# Altium schematic sheet 5V0BUCK.SchDoc
size A
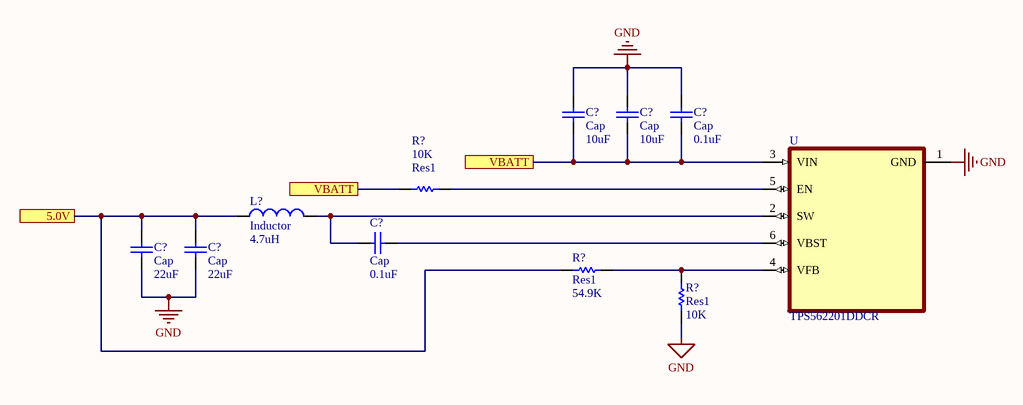
[diagram p0: 5V0BUCK.SchDoc]

## Parts
(Parts that share a designator on the sheet are numbered #1, #2 ... from top to bottom, then left to right.)
C?#1  Cap  value 10uF  [RAD-0.3]
C?#2  Cap  value 10uF  [RAD-0.3]
C?#3  Cap  value 0.1uF  [RAD-0.3]
C?#4  Cap  value 0.1uF  [RAD-0.3]
C?#5  Cap  value 22uF  [RAD-0.3]
C?#6  Cap  value 22uF  [RAD-0.3]
L?  Inductor  value 4.7uH  [0402-A]
R?#1  Res1  value 10K  [AXIAL-0.3]
R?#2  Res1  value 54.9K  [AXIAL-0.3]
R?#3  Res1  value 10K  [AXIAL-0.3]
U  TPS562201DDCR  [SOT95P280X110-6N]

## Ports
5.0V, VBATT

## Nets
GND: C?#1.2 C?#2.2 C?#3.2 C?#5.1 C?#6.1 R?#3.1 U.1(GND)
5.0V: C?#5.2 C?#6.2 L?.1 R?#2.2 ; port 5.0V
VBATT: C?#1.1 C?#2.1 C?#3.1 R?#1.2 U.3(VIN) ; port VBATT
NetC?#4_1: C?#4.1 L?.2 U.2(SW)
NetC?#4_2: C?#4.2 U.6(VBST)
NetR?#1_1: R?#1.1 U.5(EN)
NetR?#2_1: R?#2.1 R?#3.2 U.4(VFB)

## Library data of the parts
C?#1-C?#6 = Cap: Capacitor; Published: 8-Jun-2000; LatestRevisionDate: 17-Jul-2002; LatestRevisionNote: Re-released for DXP Platform.; PackageReference: RAD-0.3; Publisher: Altium Limited; PackageDescription: Radial Cap, Thru-Hole; 2 Leads; 0.3 in Pin Spacing
L? = Inductor: Code_IEC: 1005; Published: 8-Jun-2000; LatestRevisionDate: 29-May-2009; LatestRevisionNote: IPC-7351 Footprint Added.; PackageReference: 0402-A; Publisher: Altium Limited; PackageDescription: Chip Inductor; Code_JEITA: 0402
R?#1-R?#3 = Res1: Resistor; Published: 8-Jun-2000; LatestRevisionDate: 17-Jul-2002; LatestRevisionNote: Re-released for DXP Platform.; PackageReference: AXIAL-0.3; Publisher: Altium Limited; PackageDescription: Axial Device, Thru-Hole; 2 Leads; 0.3 in Pin Spacing
U = TPS562201DDCR: 4.5 V to 17 V input, 2 A output, synchronous step-down converter in Eco-mode 6-SOT-23-THIN -40 to 125; MF: Texas Instruments; Availability: Good; Value: *; Texas_Instruments-Purchase-URL: https://snapeda.com/shop?store=Texas+Instruments&id=1237932; Package: SOT-23-THN-6 Texas Instruments; DigiKey-Purchase-URL: https://snapeda.com/shop?store=DigiKey&id=1237932; MP: TPS562201DDCR; Price: None; SnapEDA_Link: https://www.snapeda.com/parts/TPS562201DDCR/Texas%20Instruments/view-part/1237932/?ref=snap; Mouser-Purchase-URL: https://snapeda.com/shop?store=Mouser&id=1237932